# Altium schematic sheet RcMPPT-DCDC.SchDoc: RcMPPT-DCDC
size A4; Author: Thomas Hofmann; Address2: HTBLuVA St. Pölten; Address3: Thomas Hofmann; DocumentNumber: 3; Revision: 1.0; SheetNumber: 3; SheetTotal: 4
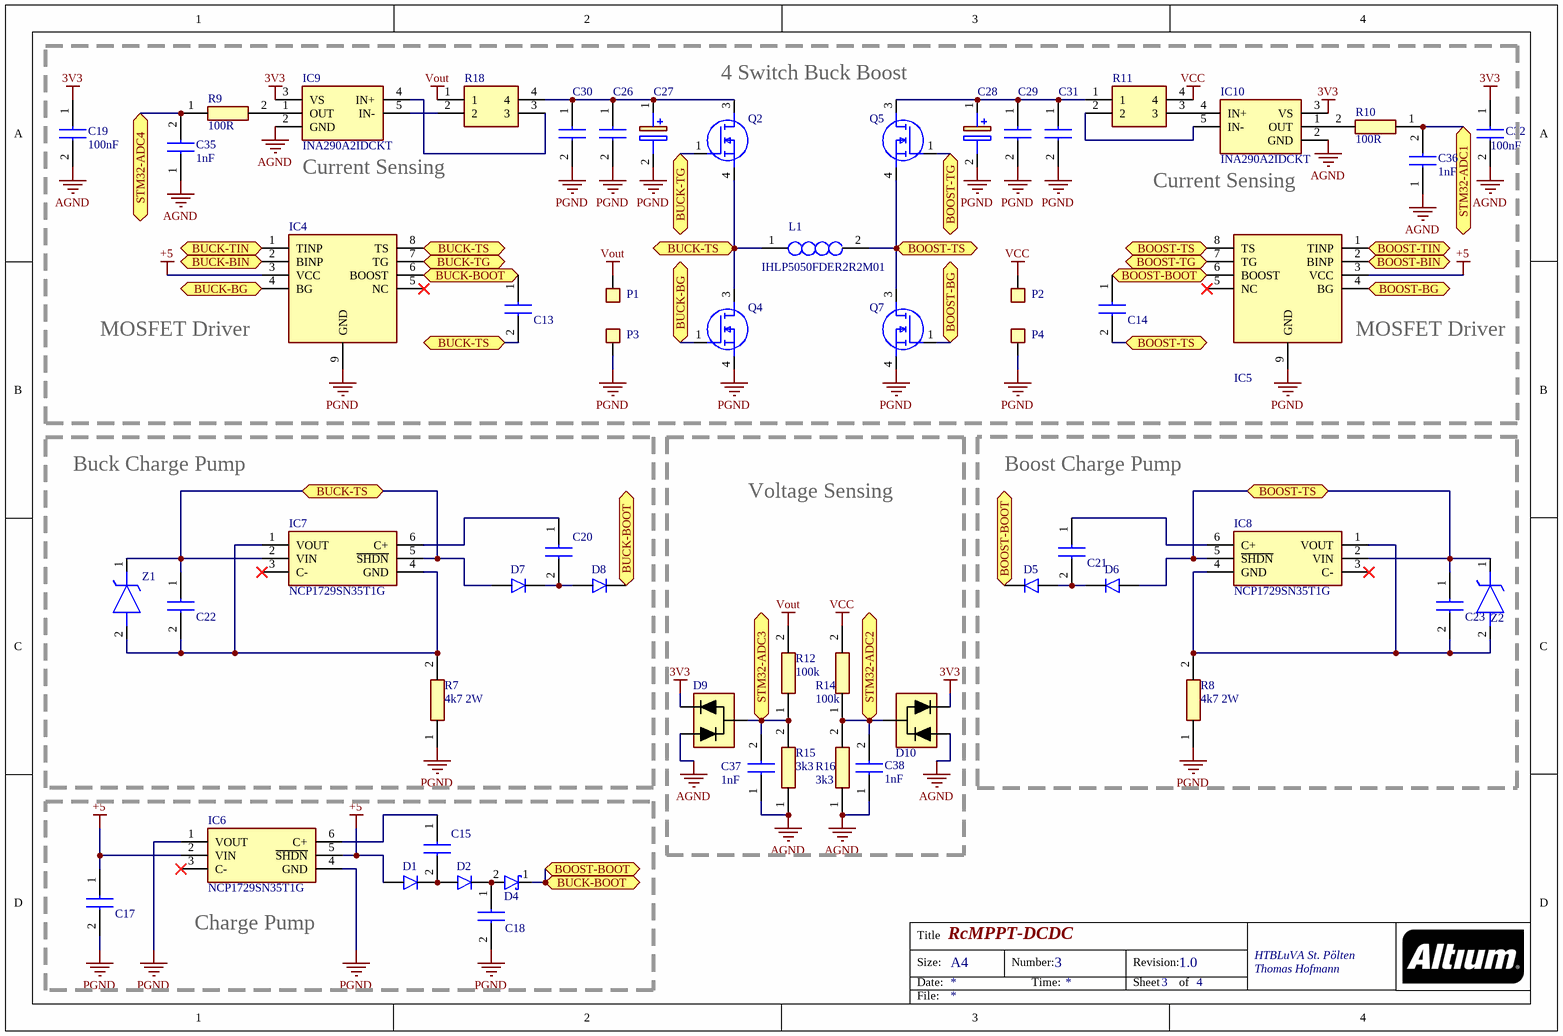
[diagram p0: RcMPPT-DCDC.SchDoc]

## Parts
C13  C1608X5R1E335K080AC  [CAPC1608X90N]  (value not drawn)
C14  C1608X5R1E335K080AC  [CAPC1608X90N]  (value not drawn)
C15  C1608X5R1E335K080AC  [CAPC1608X90N]  (value not drawn)
C17  C1608X5R1E335K080AC  [CAPC1608X90N]  (value not drawn)
C18  C1608X5R1E335K080AC  [CAPC1608X90N]  (value not drawn)
C19  100nF  [CAPC1608X97N]
C20  C1608X5R1E335K080AC  [CAPC1608X90N]  (value not drawn)
C21  C1608X5R1E335K080AC  [CAPC1608X90N]  (value not drawn)
C22  C1608X5R1E335K080AC  [CAPC1608X90N]  (value not drawn)
C23  C1608X5R1E335K080AC  [CAPC1608X90N]  (value not drawn)
C26  GRM32EC72A106KE05L  [CAPC3225X270N]  (value not drawn)
C27  UUX2A470MNL1GS  [CAPAE1030X1050N]  (value not drawn)
C28  UUX2A470MNL1GS  [CAPAE1030X1050N]  (value not drawn)
C29  GRM32EC72A106KE05L  [CAPC3225X270N]  (value not drawn)
C30  GRM32EC72A106KE05L  [CAPC3225X270N]  (value not drawn)
C31  GRM32EC72A106KE05L  [CAPC3225X270N]  (value not drawn)
C32  100nF  [CAPC1608X97N]
C35  1nF  [CAPC1608X90N]
C36  1nF  [CAPC1608X90N]
C37  1nF  [CAPC1608X90N]
C38  1nF  [CAPC1608X90N]
D1  BAS3010A03WE6327HTSA1  [SOD2513X110N]  (value not drawn)
D2  BAS3010A03WE6327HTSA1  [SOD2513X110N]  (value not drawn)
D4  V8PAM10S-M3_H  [V8PAM10SHM3H]  (value not drawn)
D5  BAS3010A03WE6327HTSA1  [SOD2513X110N]  (value not drawn)
D6  BAS3010A03WE6327HTSA1  [SOD2513X110N]  (value not drawn)
D7  BAS3010A03WE6327HTSA1  [SOD2513X110N]  (value not drawn)
D8  BAS3010A03WE6327HTSA1  [SOD2513X110N]  (value not drawn)
D9  BAT54SQ-7-F  [SOT96P240X110-3N]  (value not drawn)
D10  BAT54SQ-7-F  [SOT96P240X110-3N]  (value not drawn)
IC4  LTC4444EMS8E-5#PBF  [SOP65P490X110-9N]  (value not drawn)
IC5  LTC4444EMS8E-5#PBF  [SOP65P490X110-9N]  (value not drawn)
IC6  NCP1729SN35T1G  [SOT105P275X110-6N]
IC7  NCP1729SN35T1G  [SOT105P275X110-6N]
IC8  NCP1729SN35T1G  [SOT105P275X110-6N]
IC9  INA290A2IDCKT  [SOT65P210X110-5N]
IC10  INA290A2IDCKT  [SOT65P210X110-5N]
L1  IHLP5050FDER2R2M01  [INDPM132129X650N]
P1  PowerPad  [POWER_PAD]  (value not drawn)
P2  PowerPad  [POWER_PAD]  (value not drawn)
P3  PowerPad  [POWER_PAD]  (value not drawn)
P4  PowerPad  [POWER_PAD]  (value not drawn)
Q2  IPD90N10S4L06ATMA1  [IPD90N10S4L06ATMA1]  (value not drawn)
Q4  IPD90N10S4L06ATMA1  [IPD90N10S4L06ATMA1]  (value not drawn)
Q5  IPD90N10S4L06ATMA1  [IPD90N10S4L06ATMA1]  (value not drawn)
Q7  IPD90N10S4L06ATMA1  [IPD90N10S4L06ATMA1]  (value not drawn)
R7  4k7 2W  [RESC3263X80N]
R8  4k7 2W  [RESC3263X80N]
R9  100R  [RESC1608X55N]
R10  100R  [RESC1608X55N]
R11  WSK1216L5000FEA  [WSK12161L000FEA]  (value not drawn)
R12  100k  [RESC1608X55N]
R14  100k  [RESC1608X55N]
R15  3k3  [RESC1608X55N]
R16  3k3  [RESC1608X55N]
R18  WSK1216L5000FEA  [WSK12161L000FEA]  (value not drawn)
Z1  YFZVFHTR10B  [TDZVTR51]  (value not drawn)
Z2  YFZVFHTR10B  [TDZVTR51]  (value not drawn)

## Blocks framed on the sheet
Buck Charge Pump: C20 C22 D7 D8 IC7 R7 Z1
Voltage Sensing: C37 C38 D9 D10 R12 R14-R16
Boost Charge Pump: C21 C23 D5 D6 IC8 R8 Z2
Charge Pump: C15 C17 C18 D1 D2 D4 IC6

## Ports
BOOST-BG (bidir), BOOST-BIN (bidir), BOOST-BOOT (bidir), BOOST-TG (bidir), BOOST-TIN (bidir), BOOST-TS (bidir), BUCK-BG (bidir), BUCK-BIN (bidir), BUCK-BOOT (bidir), BUCK-TG (bidir), BUCK-TIN (bidir), BUCK-TS (bidir), STM32-ADC1 (bidir), STM32-ADC2 (bidir), STM32-ADC3 (bidir), STM32-ADC4 (bidir)

## Nets
3V3: C19.1 C32.1 D9.2(K) D10.2(K) IC9.3(VS) IC10.3(VS)
+5: C17.1 D1.2(A) IC4.3(VCC) IC5.3(VCC) IC6.2(VIN) IC6.5(~{SHDN})
AGND: C19.2 C32.2 C35.1 C36.1 C37.1 C38.1 D9.1(A) D10.1(A) IC9.2(GND) IC10.2(GND) R15.1 R16.1
PGND: C17.2 C18.2 C26.2 C27.2(-) C28.2(-) C29.2 C30.2 C31.2 IC4.9(GND) IC5.9(GND) IC6.1(VOUT) IC6.4(GND) P3.1 P4.1 Q4.4(S) Q7.4(S) R7.1 R8.1
VCC: P2.1 R11.4 R14.2
Vout: P1.1 R12.2 R18.1
BOOST-BG: IC5.4(BG) Q7.1(G) ; port BOOST-BG
BOOST-BIN: IC5.2(BINP) ; port BOOST-BIN
BOOST-BOOT: C13.1 C14.1 D4.1(K) D5.1(K) D8.1(K) IC4.6(BOOST) IC5.6(BOOST) ; port BOOST-BOOT, port BUCK-BOOT
BOOST-TG: IC5.7(TG) Q5.1(G) ; port BOOST-TG
BOOST-TIN: IC5.1(TINP) ; port BOOST-TIN
BOOST-TS: C14.2 C23.1 D6.2(A) IC5.8(TS) IC8.2(VIN) IC8.5(~{SHDN}) L1.2 Q5.4(S) Q7.3(D) Z2.1(K) ; port BOOST-TS
BUCK-BG: IC4.4(BG) Q4.1(G) ; port BUCK-BG
BUCK-BIN: IC4.2(BINP) ; port BUCK-BIN
BUCK-TG: IC4.7(TG) Q2.1(G) ; port BUCK-TG
BUCK-TIN: IC4.1(TINP) ; port BUCK-TIN
BUCK-TS: C13.2 C22.1 D7.2(A) IC4.8(TS) IC7.2(VIN) IC7.5(~{SHDN}) L1.1 Q2.4(S) Q4.3(D) Z1.1(K) ; port BUCK-TS
STM32-ADC1: C36.2 R10.1 ; port STM32-ADC1
STM32-ADC2: C38.2 D10.3(A/K) R14.1 R16.2 ; port STM32-ADC2
STM32-ADC3: C37.2 D9.3(A/K) R12.1 R15.2 ; port STM32-ADC3
STM32-ADC4: C35.2 R9.1 ; port STM32-ADC4
NetC15_1: C15.1 IC6.6(C+)
NetC15_2: C15.2 D1.1(K) D2.2(A)
NetC18_1: C18.1 D2.1(K) D4.2(A)
NetC20_1: C20.1 IC7.6(C+)
NetC20_2: C20.2 D7.1(K) D8.2(A)
NetC21_1: C21.1 IC8.6(C+)
NetC21_2: C21.2 D5.2(A) D6.1(K)
NetC22_2: C22.2 IC7.1(VOUT) IC7.4(GND) R7.2 Z1.2(A)
NetC23_2: C23.2 IC8.1(VOUT) IC8.4(GND) R8.2 Z2.2(A)
NetC26_1: C26.1 C27.1(+) C30.1 Q2.3(D) R18.4
NetC28_1: C28.1(+) C29.1 C31.1 Q5.3(D) R11.1
NetIC9_1: IC9.1(OUT) R9.2
NetIC9_4: IC9.4(IN+) R18.3
NetIC9_5: IC9.5(IN-) R18.2
NetIC10_1: IC10.1(OUT) R10.2
NetIC10_4: IC10.4(IN+) R11.3
NetIC10_5: IC10.5(IN-) R11.2

Not connected (* = marked no-connect by the designer): IC4 5(NC)*; IC5 5(NC)*; IC6 3(C-)*; IC7 3(C-)*; IC8 3(C-)*

## Notes on the sheet
- 4 Switch Buck Boost
- Current Sensing
- (near IC10) Current Sensing
- (near IC4) MOSFET Driver
- (near IC5) MOSFET Driver
- Title
- Size:
- Date:
- A4
- Number:
- Time:
- Revision:
- Sheet
- of
- File:

## Library data of the parts
C13-C15 C17 C18 C20-C23 = C1608X5R1E335K080AC: Capacitor; Manufacturer_Name: TDK; Datasheet Link: https://product.tdk.com/info/en/catalog/datasheets/mlcc_commercial_midvoltage_en.pdf; Height: 0.9mm; Manufacturer_Part_Number: C1608X5R1E335K080AC; Arrow Part Number: C1608X5R1E335K080AC; Arrow Price/Stock: https://www.arrow.com/en/products/c1608x5r1e335k080ac/tdk; Mouser Part Number: 810-C1608X5R1E335KAC; Mouser Price/Stock: https://www.mouser.com/Search/Refine.aspx?Keyword=810-C1608X5R1E335KAC
C19 C32 = VJ0603Y104JXJAC: Capacitor; Manufacturer_Name: Vishay; Datasheet Link: http://www.vishay.com/docs/45226/vj31xrohsautomlcc.pdf; Height: 0.97mm; Manufacturer_Part_Number: VJ0603Y104JXJAC; Mouser Part Number: 77-VJ0603Y104JXJAC; Mouser Price/Stock: https://www.mouser.com/Search/Refine.aspx?Keyword=77-VJ0603Y104JXJAC
C26 C29-C31 = GRM32EC72A106KE05L: Capacitor; Manufacturer_Name: Murata Electronics; Datasheet Link: http://psearch.en.murata.com/capacitor/product/GRM32ER71E226KE15%23.pdf; Height: 2.7mm; Manufacturer_Part_Number: GRM32EC72A106KE05L; Mouser Part Number: 81-GRM32EC72A106KE05; Mouser Price/Stock: https://www.mouser.co.uk/ProductDetail/Murata-Electronics/GRM32EC72A106KE05L?qs=5aG0NVq1C4yOgpL0%2FICNsw%3D%3D; Arrow Part Number: GRM32EC72A106KE05L; Arrow Price/Stock: https://www.arrow.com/en/products/grm32ec72a106ke05l/murata-manufacturing
C27 C28 = UUX2A470MNL1GS: Capacitor Polarised; Manufacturer_Name: Nichicon; Datasheet Link: https://componentsearchengine.com/Datasheets/1/UUX2A470MNL1GS.pdf; Height: 10.5mm; Manufacturer_Part_Number: UUX2A470MNL1GS; Mouser Part Number: 647-UUX2A470MNL1GS; Mouser Price/Stock: https://www.mouser.co.uk/ProductDetail/Nichicon/UUX2A470MNL1GS?qs=jZZh9D7uMhmPZMofMKn2Fg%3D%3D; Arrow Part Number: UUX2A470MNL1GS; Arrow Price/Stock: https://www.arrow.com/en/products/uux2a470mnl1gs/nichicon
C35-C38 = 06035A102JAT2A: Capacitor; Manufacturer_Name: AVX; Datasheet Link: http://datasheets.avx.com/C0GNP0-Dielectric.pdf; Height: 0.9mm; Manufacturer_Part_Number: 06035A102JAT2A; Mouser Part Number: 581-06035A102J; Mouser Price/Stock: https://www.mouser.co.uk/ProductDetail/AVX/06035A102JAT2A?qs=I5rfTV0A4wGLF2%252B95sWyMg%3D%3D; Arrow Part Number: 06035A102JAT2A; Arrow Price/Stock: https://www.arrow.com/en/products/06035a102jat2a/avx
D1 D2 D5-D8 = BAS3010A03WE6327HTSA1: Diode; Manufacturer_Name: Infineon; Datasheet Link: https://www.infineon.com/dgdl/Infineon-BAS3010ASERIES-DS-v01_01-en.pdf?fileId=db3a30431ddc9372011dfbc50f231c06; Height: 1.1mm; Manufacturer_Part_Number: BAS3010A03WE6327HTSA1; Arrow Part Number: BAS3010A03WE6327HTSA1; Arrow Price/Stock: https://www.arrow.com/en/products/bas3010a03we6327htsa1/infineon-technologies-ag; Mouser Part Number: 726-BAS3010A-03WE6; Mouser Price/Stock: https://www.mouser.co.uk/ProductDetail/Infineon-Technologies/BAS3010A03WE6327HTSA1?qs=K00xGehIljtEbk1%252B2pLZ%252BQ%3D%3D
D4 = V8PAM10S-M3_H: Schottky Diode; Manufacturer_Name: Vishay; Manufacturer_Part_Number: V8PAM10S-M3/H; Datasheet Link: https://www.vishay.com/docs/87013/v8pam10s.pdf; Height: 1mm; Mouser Part Number: 78-V8PAM10S-M3/H; Mouser Price/Stock: https://www.mouser.co.uk/ProductDetail/Vishay-General-Semiconductor/V8PAM10S-M3-H/?qs=7MVldsJ5Uazp%2FkF6tV7Ktw%3D%3D
D9 D10 = BAT54SQ-7-F: Schottky Diode; Manufacturer_Name: Diodes Inc.; Datasheet Link: https://www.arrow.com/en/products/bat54sq-7-f/diodes-incorporated; Height: 1.1mm; Manufacturer_Part_Number: BAT54SQ-7-F; Mouser Part Number: 621-BAT54SQ-7-F; Mouser Price/Stock: https://www.mouser.co.uk/ProductDetail/Diodes-Incorporated/BAT54SQ-7-F/?qs=vdQOMtKMWaAKaYcjx11stw%3D%3D; Arrow Part Number: BAT54SQ-7-F; Arrow Price/Stock: https://www.arrow.com/en/products/bat54sq-7-f/diodes-incorporated
IC4 IC5 = LTC4444EMS8E-5#PBF: Integrated Circuit; Manufacturer_Name: Linear Technology; Datasheet Link: http://www.linear.com/docs/26366; Height: 1.1mm; Manufacturer_Part_Number: LTC4444EMS8E-5#PBF; Arrow Part Number: LTC4444EMS8E-5#PBF; Arrow Price/Stock: https://www.arrow.com/en/products/ltc4444ems8e-5pbf/linear-technology; Mouser Part Number: 584-C4444EMS8E-5PBF; Mouser Price/Stock: https://www.mouser.com/Search/Refine.aspx?Keyword=584-C4444EMS8E-5PBF
IC6-IC8 = NCP1729SN35T1G: Integrated Circuit; Manufacturer_Name: ON Semiconductor; Datasheet Link: http://www.onsemi.com/pub/Collateral/NCP1729-D.PDF; Height: 1.1mm; Manufacturer_Part_Number: NCP1729SN35T1G; Arrow Part Number: NCP1729SN35T1G; Arrow Price/Stock: https://www.arrow.com/en/products/ncp1729sn35t1g/on-semiconductor; Mouser Part Number: 863-NCP1729SN35T1G; Mouser Price/Stock: https://www.mouser.co.uk/ProductDetail/ON-Semiconductor/NCP1729SN35T1G?qs=%2FugrpAKHX8pjfXPiRUErOw%3D%3D
IC9 IC10 = INA290A2IDCKT: Integrated Circuit; Manufacturer_Name: Texas Instruments; Datasheet Link: https://www.ti.com/lit/ds/symlink/ina290.pdf?ts=1605766072094&ref_url=https%253A%252F%252Fwww.ti.com%252Fstore%252Fti%252Fen%252Fp%252Fproduct%252F%253Fp%253DINA290A2IDCKT; Height: 1.1mm; Manufacturer_Part_Number: INA290A2IDCKT; Mouser Part Number: 595-INA290A2IDCKT; Mouser Price/Stock: https://www.mouser.co.uk/ProductDetail/Texas-Instruments/INA290A2IDCKT/?qs=sPbYRqrBIVkkx%2FoqcXF%2FVw%3D%3D
L1 = IHLP5050FDER2R2M01: Inductor; Manufacturer_Name: Vishay; Datasheet Link: http://uk.rs-online.com/web/p/products/7487448P; Height: 6.5mm; Manufacturer_Part_Number: IHLP5050FDER2R2M01; Mouser Part Number: 70-IHLP5050FDER2R2M1; Mouser Price/Stock: https://www.mouser.co.uk/ProductDetail/Vishay-Dale/IHLP5050FDER2R2M01?qs=bGpylJ3EYaCbgSSjAcbJVQ%3D%3D; Arrow Part Number: IHLP5050FDER2R2M01; Arrow Price/Stock: https://www.arrow.com/en/products/ihlp5050fder2r2m01/vishay
Q2 Q4 Q5 Q7 = IPD90N10S4L06ATMA1: MOSFET (N-Channel); Manufacturer_Name: Infineon; Datasheet Link: https://www.infineon.com/dgdl/Infineon-IPD90N10S4L_06-DS-v01_00-en.pdf?fileId=db3a3043372d5cc80137500063630512; Height: 2mm; Manufacturer_Part_Number: IPD90N10S4L06ATMA1; Arrow Part Number: IPD90N10S4L06ATMA1; Arrow Price/Stock: https://www.arrow.com/en/products/ipd90n10s4l06atma1/infineon-technologies-ag; Mouser Part Number: 726-IPD90N10S4L06ATM; Mouser Price/Stock: https://www.mouser.co.uk/ProductDetail/Infineon-Technologies/IPD90N10S4L06ATMA1?qs=LxJ0xX%2FWJR62lwU%2FrihEDA%3D%3D
R7 R8 = RCL12254K70FKEG: Resistor; Manufacturer_Name: Vishay; Datasheet Link: https://componentsearchengine.com/Datasheets/1/RCL12254K70FKEG.pdf; Height: 0.8mm; Manufacturer_Part_Number: RCL12254K70FKEG; Mouser Part Number: 71-RCL12254K70FKEG; Mouser Price/Stock: https://www.mouser.com/Search/Refine.aspx?Keyword=71-RCL12254K70FKEG
R9 R10 = ERJ-3EKF1000V: Resistor; Manufacturer_Name: Panasonic; Datasheet Link: http://industrial.panasonic.com/cdbs/www-data/pdf/RDA0000/AOA0000C86.pdf; Height: 0.55mm; Manufacturer_Part_Number: ERJ-3EKF1000V; Mouser Part Number: 667-ERJ-3EKF1000V; Mouser Price/Stock: https://www.mouser.co.uk/ProductDetail/Panasonic/ERJ-3EKF1000V/?qs=H7k1u0Mp9JS7i8KGO5m47A%3D%3D; Arrow Part Number: ERJ-3EKF1000V; Arrow Price/Stock: https://www.arrow.com/en/products/erj-3ekf1000v/panasonic
R11 R18 = WSK1216L5000FEA: Resistor; Manufacturer_Name: Vishay; Datasheet Link: http://www.vishay.com/docs/30189/wsk1216.pdf; Height: 1.9mm; Manufacturer_Part_Number: WSK1216L5000FEA
R12 R14 = ERJ-PA3J104V: Resistor; Manufacturer_Name: Panasonic; Datasheet Link: https://industrial.panasonic.com/cdbs/www-data/pdf/RDA0000/AOA0000C243.pdf; Height: 0.55mm; Manufacturer_Part_Number: ERJ-PA3J104V; Mouser Part Number: 667-ERJ-PA3J104V; Mouser Price/Stock: https://www.mouser.com/Search/Refine.aspx?Keyword=667-ERJ-PA3J104V; Arrow Part Number: ERJ-PA3J104V; Arrow Price/Stock: https://www.arrow.com/en/products/erj-pa3j104v/panasonic
R15 R16 = ERJ-PA3J332V: Resistor; Manufacturer_Name: Panasonic; Datasheet Link: https://industrial.panasonic.com/cdbs/www-data/pdf/RDO0000/AOA0000C331.pdf; Height: 0.55mm; Manufacturer_Part_Number: ERJ-PA3J332V; Mouser Part Number: 667-ERJ-PA3J332V; Mouser Price/Stock: https://www.mouser.co.uk/ProductDetail/Panasonic/ERJ-PA3J332V?qs=BzJM0faLVqUb4RD3AQ1dMg%3D%3D
Z1 Z2 = YFZVFHTR10B: Zener Diode; Manufacturer_Name: ROHM Semiconductor; Datasheet Link: http://rohmfs.rohm.com/en/products/databook/datasheet/discrete/diode/zener/yfzvfhtr10b-e.pdf; Height: 0.8mm; Manufacturer_Part_Number: YFZVFHTR10B; Mouser Part Number: 755-YFZVFHTR10B; Mouser Price/Stock: https://www.mouser.com/Search/Refine.aspx?Keyword=755-YFZVFHTR10B